# Altium schematic sheet POWER.SchDoc: Bison-Board
size A4; DrawnBy: mzy2364; Revision: V1.4
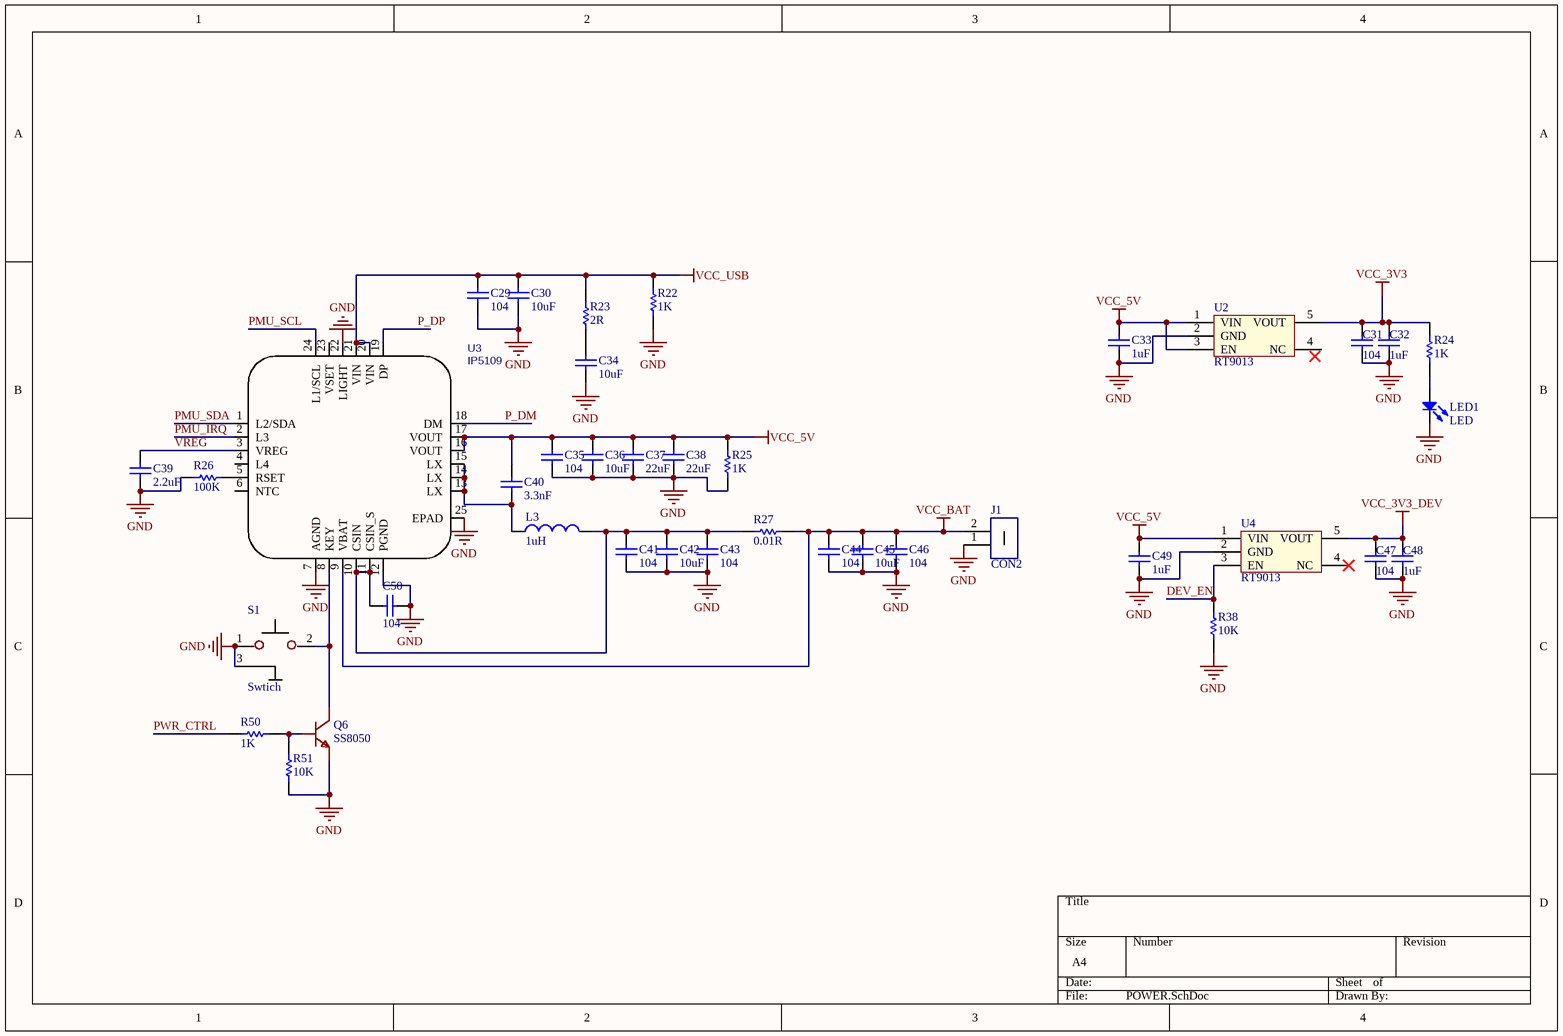
[diagram p0: POWER.SchDoc]

## Parts
C29  104  [C 0603]
C30  10uF  [C 0603]
C31  104  [C 0603]
C32  1uF  [C 0603]
C33  1uF  [C 0603]
C34  10uF  [C 0603]
C35  104  [C 0603]
C36  10uF  [C 0603]
C37  22uF  [C 0603]
C38  22uF  [C 0603]
C39  2.2uF  [C 0603]
C40  3.3nF  [C 0603]
C41  104  [C 0603]
C42  10uF  [C 0603]
C43  104  [C 0603]
C44  104  [C 0603]
C45  10uF  [C 0603]
C46  104  [C 0603]
C47  104  [C 0603]
C48  1uF  [C 0603]
C49  1uF  [C 0603]
C50  104  [C 0603]
J1  CON2  [XH-2P-SMD]
L3  1uH  [L_7*7]
LED1  LED  [0603_LED]
Q6  SS8050  [SOT-23]
R22  1K  [R 0603]
R23  2R  [R 0603]
R24  1K  [R 0603]
R25  1K  [R 0603]
R26  100K  [R 0603]
R27  0.01R  [R 1206]
R38  10K  [R 0603]
R50  1K  [R 0603]
R51  10K  [R 0603]
S1  Swtich  [SW3*6]
U2  RT9013  [SOT23-5]
U3  IP5109  [QFN-24]
U4  RT9013  [SOT23-5]

## Nets
GND: C29.1 C30.1 C31.1 C32.1 C33.1 C34.1 C35.1 C36.1 C37.1 C38.1 C39.1 C41.1 C42.1 C43.1 C44.1 C45.1 C46.1 C47.1 C48.1 C49.1 C50.1 J1.1 LED1.2(K) Q6.2(E) R22.1 R25.1 R26.2 R38.1 R51.1 S1.1 S1.3 U2.2(GND) U3.7(AGND) U3.12(PGND) U3.22(LIGHT) U3.25(EPAD) U4.2(GND)
VCC_3V3: C31.2 C32.2 R24.2 U2.5(VOUT)
VCC_3V3_DEV: C47.2 C48.2 U4.5(VOUT)
VCC_5V: C33.2 C35.2 C36.2 C37.2 C38.2 C40.2 C49.2 R25.2 U2.1(VIN) U2.3(EN) U3.16(VOUT) U3.17(VOUT) U4.1(VIN)
VCC_BAT: C44.2 C45.2 C46.2 J1.2 R27.1 U3.9(VBAT)
VCC_USB: C29.2 C30.2 R22.2 R23.2 U3.20(VIN) U3.21(VIN)
DEV_EN: R38.2 U4.3(EN)
P_DM: U3.18(DM)
P_DP: U3.19(DP)
PMU_IRQ: U3.2(L3)
PMU_SCL: U3.24(L1/SCL)
PMU_SDA: U3.1(L2/SDA)
PWR_CTRL: R50.2
VREG: C39.2 U3.3(VREG)
NetC34_2: C34.2 R23.1
NetC40_1: C40.1 L3.1 U3.13(LX) U3.14(LX) U3.15(LX)
NetC41_2: C41.2 C42.2 C43.2 C50.2 L3.2 R27.2 U3.10(CSIN) U3.11(CSIN_S)
NetLED1_1: LED1.1(A) R24.1
NetQ6_1: Q6.1(B) R50.1 R51.2
NetQ6_3: Q6.3(C) S1.2 U3.8(KEY)
NetR26_1: R26.1 U3.5(RSET)

Not connected (* = marked no-connect by the designer): U2 4(NC); U3 4(L4) 6(NTC) 23(VSET); U4 4(NC)*

## Library data of the parts
C29 C30 C34-C38 C40-C46 C50 = Cap: Capacitor
C31-C33 C39 C47-C49 = CAP
L3 = Inductor
Q6 = NPN
R22-R27 R38 R50 R51 = RES
S1 = Switch-th
U2 U4 = RT9013: 500mA低压差LDO
U3 = IP5109: BOM_Manufacturer: INJOINIC; Contributor: LCSC; SMT Type: Extend; BOM_Supplier: LCSC; BOM_Supplier Part: C181699; BOM_Manufacturer Part: IP5109; BOM_LCSC Assembly: Yes; spicePre: U; spiceSymbolName: IP5109